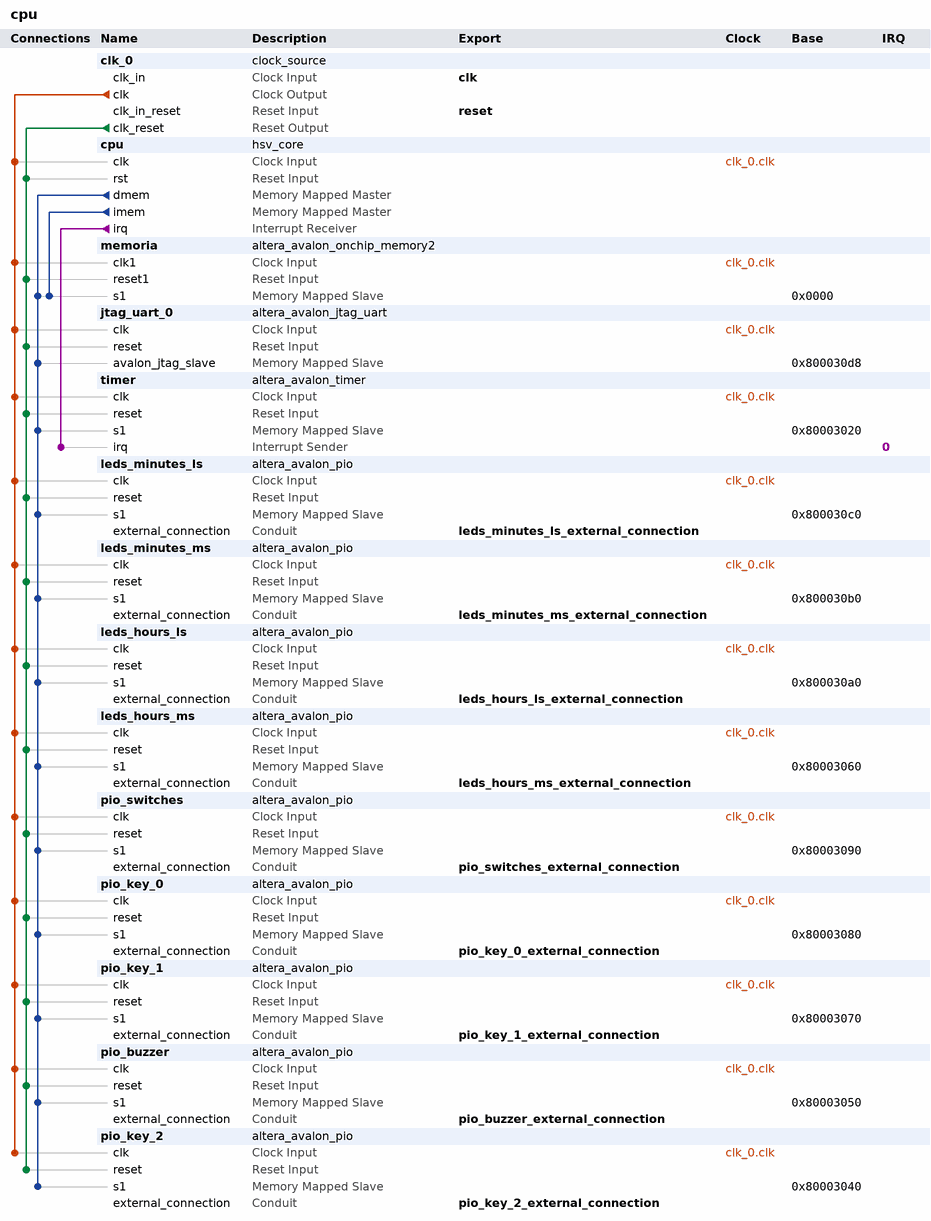
[diagram p0: system contents]
# Platform Designer (Qsys) system cpu, Cyclone V 5CSEMA5F31C6
# Parameters at their usual value, and those the tool derives, are not listed.
package require -exact qsys 23.1
create_system cpu
set_project_property DEVICE_FAMILY {Cyclone V}
set_project_property DEVICE 5CSEMA5F31C6

add_instance clk_0 clock_source 23.1
set_instance_parameter_value clk_0 clockFrequency 50000000

add_instance cpu hsv_core 1.0
set_instance_parameter_value cpu FETCH_BURST_LEN 4
set_instance_parameter_value cpu HART_ID 0

add_instance memoria altera_avalon_onchip_memory2 23.1
set_instance_parameter_value memoria dataWidth 32
set_instance_parameter_value memoria dualPort false
set_instance_parameter_value memoria initMemContent true
set_instance_parameter_value memoria initializationFileName cpu_memoria.hex
set_instance_parameter_value memoria memorySize 32768
set_instance_parameter_value memoria useNonDefaultInitFile true

add_instance jtag_uart_0 altera_avalon_jtag_uart 23.1
set_instance_parameter_value jtag_uart_0 simInteractiveOptions NO_INTERACTIVE_WINDOWS

add_instance timer altera_avalon_timer 23.1
set_instance_parameter_value timer period 1
set_instance_parameter_value timer periodUnits SEC

add_instance leds_minutes_ls altera_avalon_pio 23.1
set_instance_parameter_value leds_minutes_ls direction Output
set_instance_parameter_value leds_minutes_ls width 7

add_instance leds_minutes_ms altera_avalon_pio 23.1
set_instance_parameter_value leds_minutes_ms direction Output
set_instance_parameter_value leds_minutes_ms width 7

add_instance leds_hours_ls altera_avalon_pio 23.1
set_instance_parameter_value leds_hours_ls direction Output
set_instance_parameter_value leds_hours_ls width 7

add_instance leds_hours_ms altera_avalon_pio 23.1
set_instance_parameter_value leds_hours_ms direction Output
set_instance_parameter_value leds_hours_ms width 7

add_instance pio_switches altera_avalon_pio 23.1
set_instance_parameter_value pio_switches direction Input
set_instance_parameter_value pio_switches simDoTestBenchWiring true
set_instance_parameter_value pio_switches width 2

add_instance pio_key_0 altera_avalon_pio 23.1
set_instance_parameter_value pio_key_0 direction Input
set_instance_parameter_value pio_key_0 simDoTestBenchWiring true
set_instance_parameter_value pio_key_0 simDrivenValue 1
set_instance_parameter_value pio_key_0 width 1

add_instance pio_key_1 altera_avalon_pio 23.1
set_instance_parameter_value pio_key_1 direction Input
set_instance_parameter_value pio_key_1 simDoTestBenchWiring true
set_instance_parameter_value pio_key_1 simDrivenValue 1
set_instance_parameter_value pio_key_1 width 1

add_instance pio_buzzer altera_avalon_pio 23.1
set_instance_parameter_value pio_buzzer direction Output
set_instance_parameter_value pio_buzzer width 1

add_instance pio_key_2 altera_avalon_pio 23.1
set_instance_parameter_value pio_key_2 direction Input
set_instance_parameter_value pio_key_2 simDoTestBenchWiring true
set_instance_parameter_value pio_key_2 simDrivenValue 1
set_instance_parameter_value pio_key_2 width 1

# connections
add_connection clk_0.clk cpu.clk clock
add_connection clk_0.clk jtag_uart_0.clk clock
add_connection clk_0.clk leds_hours_ls.clk clock
add_connection clk_0.clk leds_hours_ms.clk clock
add_connection clk_0.clk leds_minutes_ls.clk clock
add_connection clk_0.clk leds_minutes_ms.clk clock
add_connection clk_0.clk memoria.clk1 clock
add_connection clk_0.clk pio_buzzer.clk clock
add_connection clk_0.clk pio_key_0.clk clock
add_connection clk_0.clk pio_key_1.clk clock
add_connection clk_0.clk pio_key_2.clk clock
add_connection clk_0.clk pio_switches.clk clock
add_connection clk_0.clk timer.clk clock
add_connection clk_0.clk_reset cpu.rst reset
add_connection clk_0.clk_reset jtag_uart_0.reset reset
add_connection clk_0.clk_reset leds_hours_ls.reset reset
add_connection clk_0.clk_reset leds_hours_ms.reset reset
add_connection clk_0.clk_reset leds_minutes_ls.reset reset
add_connection clk_0.clk_reset leds_minutes_ms.reset reset
add_connection clk_0.clk_reset memoria.reset1 reset
add_connection clk_0.clk_reset pio_buzzer.reset reset
add_connection clk_0.clk_reset pio_key_0.reset reset
add_connection clk_0.clk_reset pio_key_1.reset reset
add_connection clk_0.clk_reset pio_key_2.reset reset
add_connection clk_0.clk_reset pio_switches.reset reset
add_connection clk_0.clk_reset timer.reset reset
add_connection cpu.dmem jtag_uart_0.avalon_jtag_slave avalon
set_connection_parameter_value cpu.dmem/jtag_uart_0.avalon_jtag_slave baseAddress 0x800030d8
add_connection cpu.dmem leds_hours_ls.s1 avalon
set_connection_parameter_value cpu.dmem/leds_hours_ls.s1 baseAddress 0x800030a0
add_connection cpu.dmem leds_hours_ms.s1 avalon
set_connection_parameter_value cpu.dmem/leds_hours_ms.s1 baseAddress 0x80003060
add_connection cpu.dmem leds_minutes_ls.s1 avalon
set_connection_parameter_value cpu.dmem/leds_minutes_ls.s1 baseAddress 0x800030c0
add_connection cpu.dmem leds_minutes_ms.s1 avalon
set_connection_parameter_value cpu.dmem/leds_minutes_ms.s1 baseAddress 0x800030b0
add_connection cpu.dmem memoria.s1 avalon
set_connection_parameter_value cpu.dmem/memoria.s1 baseAddress 0x0000
add_connection cpu.dmem pio_buzzer.s1 avalon
set_connection_parameter_value cpu.dmem/pio_buzzer.s1 baseAddress 0x80003050
add_connection cpu.dmem pio_key_0.s1 avalon
set_connection_parameter_value cpu.dmem/pio_key_0.s1 baseAddress 0x80003080
add_connection cpu.dmem pio_key_1.s1 avalon
set_connection_parameter_value cpu.dmem/pio_key_1.s1 baseAddress 0x80003070
add_connection cpu.dmem pio_key_2.s1 avalon
set_connection_parameter_value cpu.dmem/pio_key_2.s1 baseAddress 0x80003040
add_connection cpu.dmem pio_switches.s1 avalon
set_connection_parameter_value cpu.dmem/pio_switches.s1 baseAddress 0x80003090
add_connection cpu.dmem timer.s1 avalon
set_connection_parameter_value cpu.dmem/timer.s1 baseAddress 0x80003020
add_connection cpu.imem memoria.s1 avalon
set_connection_parameter_value cpu.imem/memoria.s1 baseAddress 0x0000
add_connection cpu.irq timer.irq interrupt
set_connection_parameter_value cpu.irq/timer.irq irqNumber 0

# exported interfaces
add_interface clk clock sink
set_interface_property clk EXPORT_OF clk_0.clk_in
add_interface leds_hours_ls_external_connection conduit end
set_interface_property leds_hours_ls_external_connection EXPORT_OF leds_hours_ls.external_connection
add_interface leds_hours_ms_external_connection conduit end
set_interface_property leds_hours_ms_external_connection EXPORT_OF leds_hours_ms.external_connection
add_interface leds_minutes_ls_external_connection conduit end
set_interface_property leds_minutes_ls_external_connection EXPORT_OF leds_minutes_ls.external_connection
add_interface leds_minutes_ms_external_connection conduit end
set_interface_property leds_minutes_ms_external_connection EXPORT_OF leds_minutes_ms.external_connection
add_interface pio_buzzer_external_connection conduit end
set_interface_property pio_buzzer_external_connection EXPORT_OF pio_buzzer.external_connection
add_interface pio_key_0_external_connection conduit end
set_interface_property pio_key_0_external_connection EXPORT_OF pio_key_0.external_connection
add_interface pio_key_1_external_connection conduit end
set_interface_property pio_key_1_external_connection EXPORT_OF pio_key_1.external_connection
add_interface pio_key_2_external_connection conduit end
set_interface_property pio_key_2_external_connection EXPORT_OF pio_key_2.external_connection
add_interface pio_switches_external_connection conduit end
set_interface_property pio_switches_external_connection EXPORT_OF pio_switches.external_connection
add_interface reset reset sink
set_interface_property reset EXPORT_OF clk_0.clk_in_reset

set_interconnect_requirement {$system} qsys_mm.clockCrossingAdapter HANDSHAKE
set_interconnect_requirement {$system} qsys_mm.enableEccProtection FALSE
set_interconnect_requirement {$system} qsys_mm.insertDefaultSlave FALSE
set_interconnect_requirement {$system} qsys_mm.maxAdditionalLatency 1

save_system cpu.qsys
